# EAGLE design gm3-noise-suppressor (EAGLE 5.02)
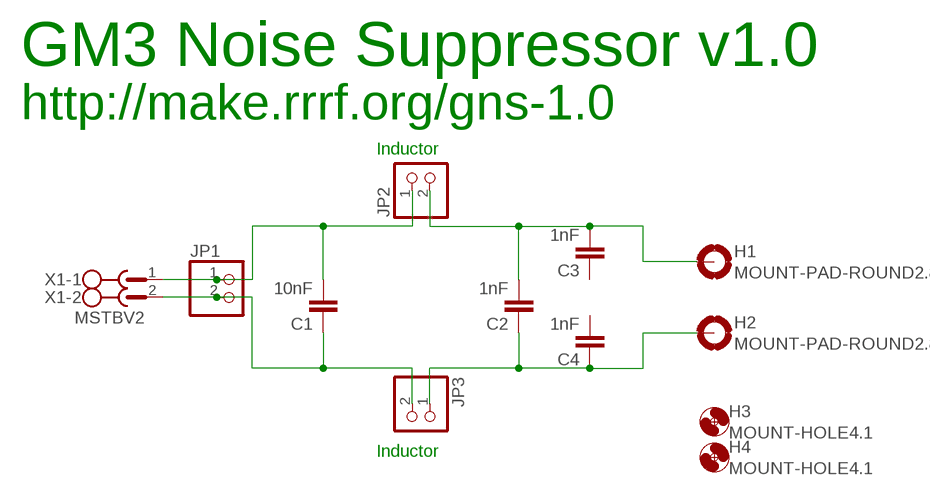
[diagram p0: schematic, sheet 1]

## Parts
C1  10nF  C-EU050-030X075  [C050-030X075]
C2  1nF  C-EU050-030X075  [C050-030X075]
C3  1nF  C-EU050-030X075  [C050-030X075]
C4  1nF  C-EU050-030X075  [C050-030X075]
H1  MOUNT-PAD-ROUND2.8  [2,8-PAD]
H2  MOUNT-PAD-ROUND2.8  [2,8-PAD]
H3  MOUNT-HOLE4.1  [4,1]
H4  MOUNT-HOLE4.1  [4,1]
JP1  PINHD-1X2  [1X02]
JP2  PINHD-1X2  [1X02]
JP3  PINHD-1X2  [1X02]
X1  MSTBV2  [MSTBV2]

## Nets
N$1: C1.2 JP1.1 JP2.1 X1.1
N$2: C1.1 JP1.2 JP3.2 X1.2
N$3: C2.2 C3.2 H1.B2,8(MOUNT) JP2.2
N$5: C2.1 C4.1 H2.B2,8(MOUNT) JP3.1
Unconnected: C3.1 C4.2

## Notes on the sheet
- GM3 Noise Suppressor v1.0
- http://make.rrrf.org/gns-1.0
- Inductor
- Inductor

## Library data of the parts
C1-C4 = rcl:C-EU: CAPACITOR, European symbol
H1 H2 = holes:MOUNT-PAD-ROUND: MOUNTING PAD, round
H3 H4 = holes:MOUNT-HOLE: MOUNTING HOLE with drill center marker
JP1-JP3 = pinhead:PINHD-1X2: PIN HEADER
X1 = con-phoenix-508:MSTBV2: PHOENIX

## Net classes
0 default: width 1.676 mm, clearance 0.406 mm

## Board
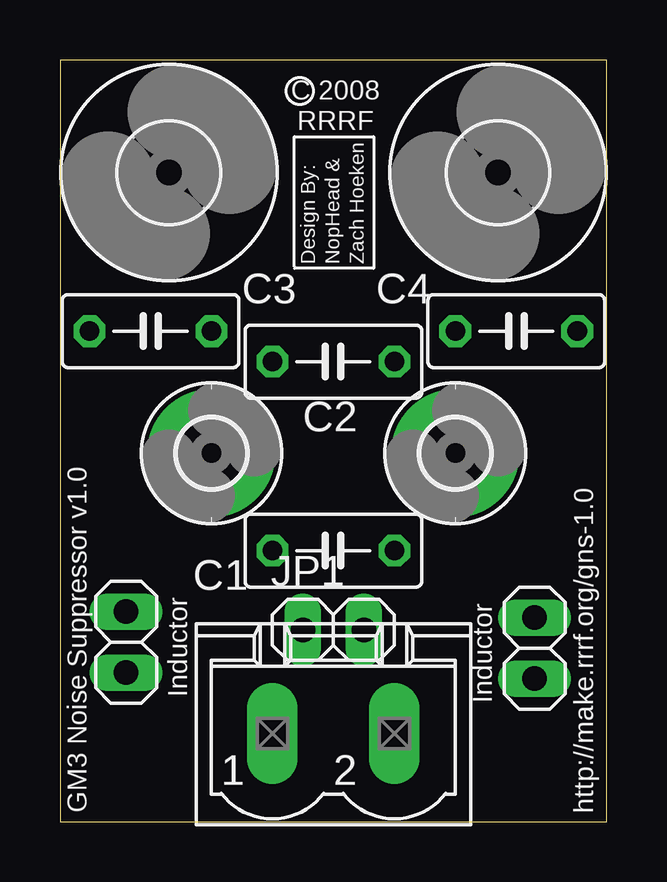
[diagram p1: board, top side]
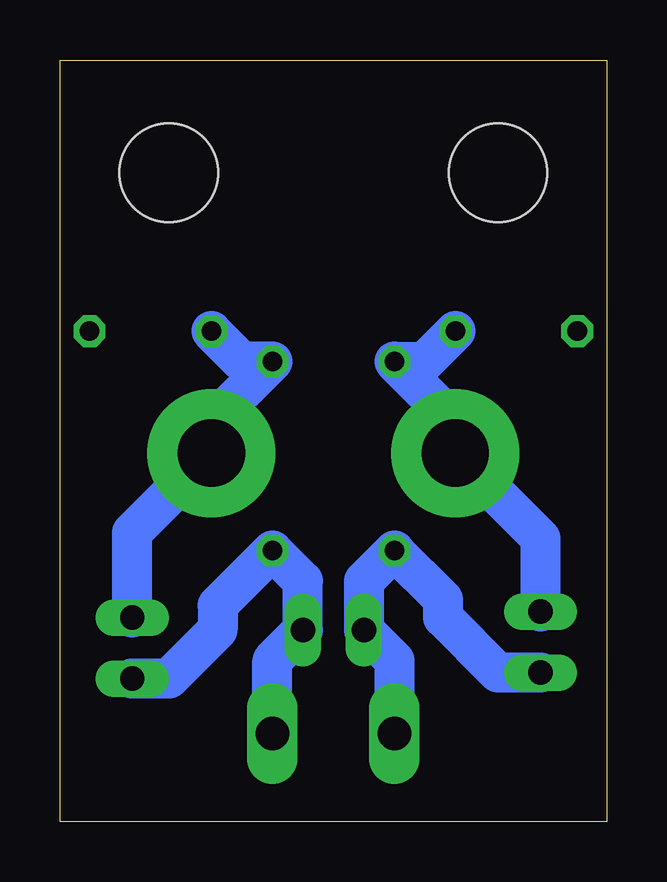
[diagram p2: board, bottom side, seen from below]

Size 22.78 x 31.74 mm. Coordinates in mm from the lower left corner, seen from the top.
Outline: 0,0 22.78,0 22.78,31.74 0,31.74 0,0
Copper layers (1*16): Top 0.035mm / dielectric 1.5mm / Bottom 0.035mm
Design rules "default": minimum track width 10mil, minimum drill 24mil, track to track 8mil, track to pad 8mil, pad to pad 8mil, via to via 8mil, smd to smd 8mil, copper to edge 40mil, drill to drill 8mil, minimum pad ring 10mil, minimum via ring 8mil, stop-mask expansion 4mil, vias tented up to drill 0mil, thermal gap 10mil

### Footprints (pad centres in the part's own frame; a part is rotated, then mirrored left to right if it is on the bottom)
C050-030X075 = drill 0.813 octagon: 1 -2.54,0; 2 2.54,0
2,8-PAD = drill 2.8 pad 5.334 round: B2,8 0,0
4,1 = hole 4.1: 0,0
1X02 = drill 1.016 long: 1 -1.27,0; 2 1.27,0
MSTBV2 = drill 1.397 long: 1 -2.54,0; 2 2.54,0

### Placement (x,y rotation side)
C1  11.39,11.3 180 top
C2  11.39,19.17 180 top
C3  3.77,20.44 0 top
C4  19.01,20.44 0 top
H1  6.31,15.36 0 top
H2  16.47,15.36 0 top
H3  4.53,27.05 0 top
H4  18.25,27.05 0 top
JP1  11.39,8 0 top
JP2  2.76,7.49 90 top
JP3  19.77,7.23 270 top
X1  11.39,3.68 0 top

### Tracks (layer width: path | path; a pad name or v marks a point on that pad's centre or on a via)
N$1
  Bottom 1.676: JP2.1 4.53,6.22 6.82,8.5 6.82,9.27 C1.2 10.12,10.03 JP1.1 8.85,6.73 X1.1
N$2
  Bottom 1.676: X1.2 13.93,6.73 JP1.2 12.66,10.03 C1.1 16.22,9.01 16.22,8 18.25,5.96 JP3.2
N$3
  Bottom 1.676: JP2.2 2.76,11.81 H1.B2,8 6.31,16.63 C2.2 7.58,19.17 C3.2
N$5
  Bottom 1.676: JP3.1 19.77,12.06 H2.B2,8 16.47,16.63 C2.1 15.2,19.17 C4.1

### Text on the board
tPlace: C 2008 | RRRF | Design By: | NopHead & | Zach Hoeken | Inductor | Inductor | GM3 Noise Suppressor v1.0 | http://make.rrrf.org/gns-1.0